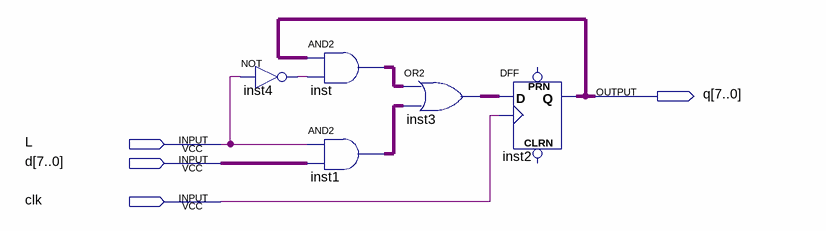
[diagram p0: schematic sheet]
// Quartus schematic com.bdf as structural Verilog: 5 symbols, 4 pins
module com (
  input  L,
  input  [7:0] d,
  input  clk,
  output [7:0] q
);

  wire inst4_out;
  wire [7:0] inst1_out, inst3_out, inst_out;

  not inst4 (inst4_out, L);
  assign inst_out = q & {8{inst4_out}};  // AND2 inst, 8 bits wide
  assign inst1_out = {8{L}} & d;  // AND2 inst1, 8 bits wide
  assign inst3_out = inst_out | inst1_out;  // OR2 inst3, 8 bits wide
  DFF inst2[7:0] (.CLK(clk), .D(inst3_out), .Q(q));  // open: CLRN, PRN
endmodule
